# Altium project TRACKER.PrjPcb (part 2 of 3)

## Sheet SLAVE.SchDoc
size A4; SheetNumber: 2; SheetTotal: 3
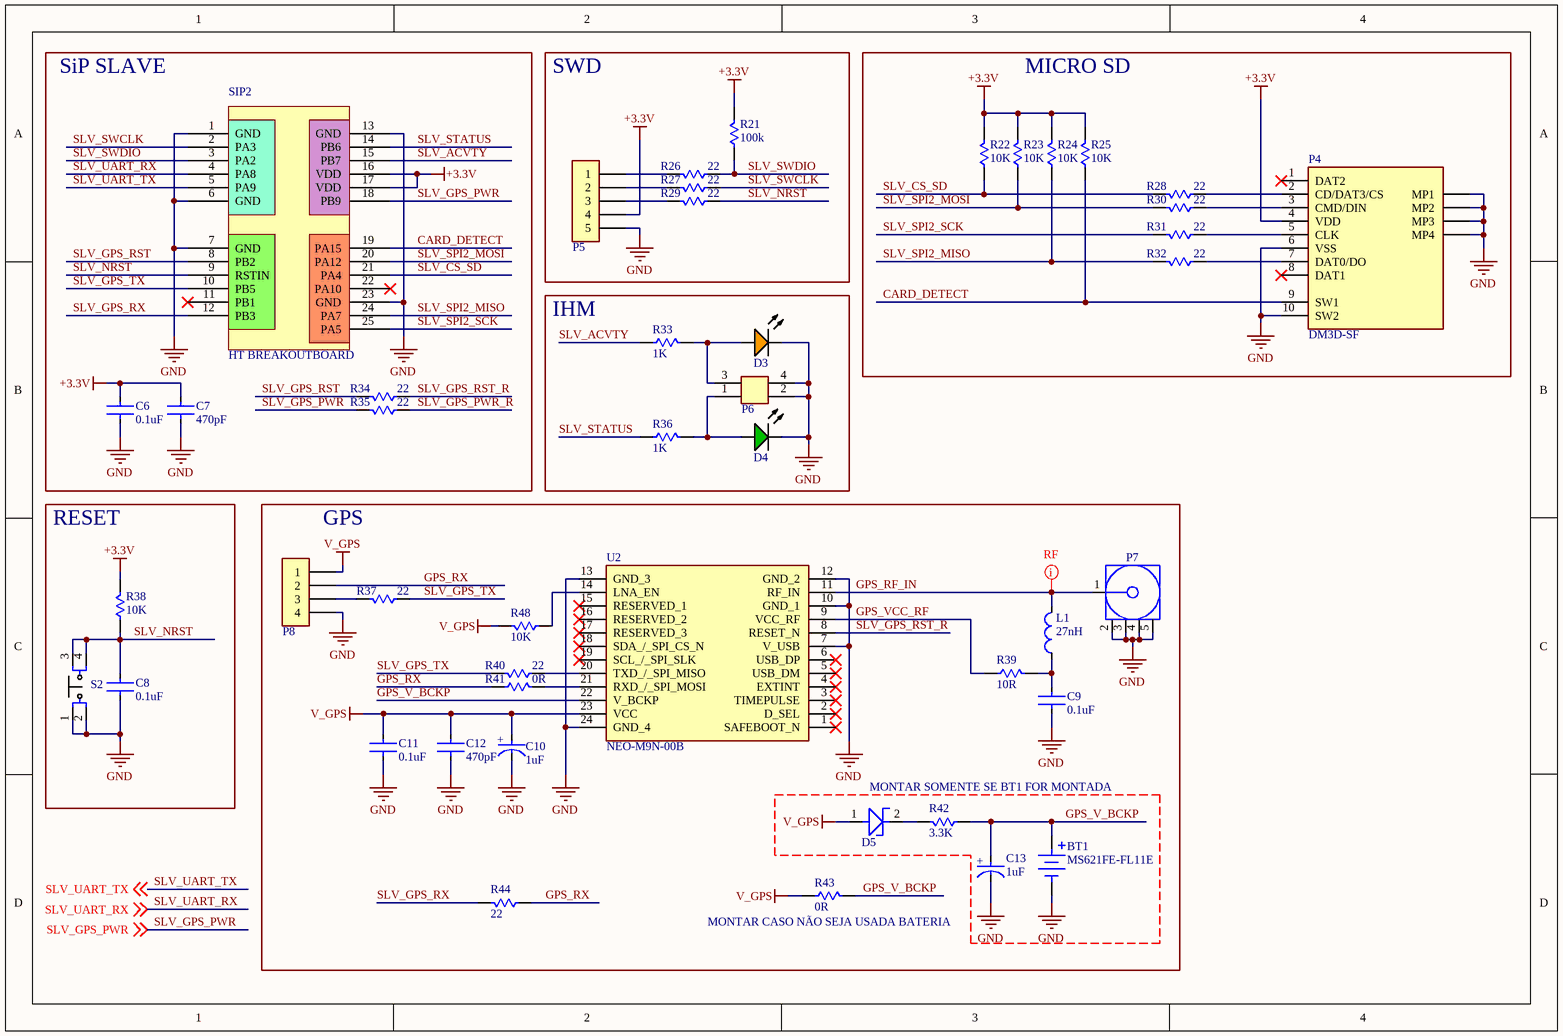
[diagram p1: SLAVE.SchDoc]

### Parts
BT1  MS621FE-FL11E  [BAT_MS621FE-FL11E]
C6  0.1uF  [0805-CAP]
C7  470pF  [0805-CAP]
C8  0.1uF  [0805-CAP]
C9  0.1uF  [0805-CAP]
C10  1uF  [1206-CAP-TANT]
C11  0.1uF  [0805-CAP]
C12  470pF  [0805-CAP]
C13  1uF  [1206-CAP-TANT]
D3  ORANGE  [0805-LED-ORANGE]  (value not drawn)
D4  GREEN  [0805-LED-GREEN]  (value not drawn)
D5  NRVB120VLSFT1G  [SOD-123]  (value not drawn)
L1  27nH  [PE-0603CD270JTT]
P4  DM3D-SF  [DM3DSF]
P5  Header 6  [_HEADER_5P_PVF]  (value not drawn)
P6  _HEADER_2X2_PVM_2.54MM  [67997-404HLF]  (value not drawn)
P7  CON-SMA-EDGE-S  [CON-SMA-EDGE-S]  (value not drawn)
P8  NEO-5M-MODULE-WITHOUT-PPS  [NEO-5M-MODULE-NO-PPS]  (value not drawn)
R21  100k  [0805-RES]
R22  10K  [0805-RES]
R23  10K  [0805-RES]
R24  10K  [0805-RES]
R25  10K  [0805-RES]
R26  22  [0805-RES]
R27  22  [0805-RES]
R28  22  [0805-RES]
R29  22  [0805-RES]
R30  22  [0805-RES]
R31  22  [0805-RES]
R32  22  [0805-RES]
R33  1K  [0805-RES]
R34  22  [0805-RES]
R35  22  [0805-RES]
R36  1K  [0805-RES]
R37  22  [0805-RES]
R38  10K  [0805-RES]
R39  10R  [0805-RES]
R40  22  [0805-RES]
R41  0R  [0805-RES]
R42  3.3K  [0805-RES]
R43  0R  [0805-RES]
R44  22  [0805-RES]
R48  10K  [0805-RES]
S2  EVQ-P7A01P  [EVQP7A]  (value not drawn)
SIP2  HT BREAKOUTBOARD  [HT BREAKOUTBOARD PINS]
U2  NEO-M9N-00B  [NEO-M9N-00B-MFG]

### Blocks framed on the sheet
SiP SLAVE: C6 C7 R34 R35 SIP2
SWD: P5 R21 R26 R27 R29
MICRO SD: P4 R22-R25 R28 R30-R32
IHM: D3 D4 P6 R33 R36
RESET: C8 R38 S2
GPS: C9-C12 L1 P7 P8 R37 R39-R41 R43 R44 R48 U2
MONTAR SOMENTE SE BT1 FOR MONTADA: BT1 C13 D5 R42

### Nets
+3.3V: C6.1 C7.1 P4.4(VDD) P5.4 R21.2 R22.2 R23.2 R24.2 R25.2 R38.2 SIP2.16(VDD) SIP2.17(VDD)
GND: BT1.NEG C6.2 C7.2 C8.2 C9.1 C10.2(C) C11.2 C12.2 C13.2(C) D3.2(K) D4.2(K) P4.6(VSS) P4.10(SW2) P4.MP1 P4.MP2 P4.MP3 P4.MP4 P5.5 P6.2 P6.4 P7.2(GND1) P7.3(GND2) P7.4(GND3) P7.5(GND4) P8.4 S2.1 S2.2 SIP2.1(GND) SIP2.6(GND) SIP2.7(GND) SIP2.13(GND) SIP2.23(GND) U2.7(V_USB) U2.10(GND_1) U2.12(GND_2) U2.13(GND_3) U2.24(GND_4)
V_GPS: C10.1(A) C11.1 C12.1 D5.1 P8.1 R43.1 R48.2 U2.23(VCC)
CARD_DETECT: P4.9(SW1) R25.1 SIP2.19(PA15)
GPS_RF_IN: L1.2 P7.1(SIGNAL) U2.11(RF_IN)
GPS_RX: P8.2 R41.1 R44.1
GPS_V_BCKP: BT1.POS C13.1(A) R42.1 R43.2 U2.22(V_BCKP)
GPS_VCC_RF: R39.1 U2.9(VCC_RF)
SLV_ACVTY: R33.1 SIP2.15(PB7)
SLV_CS_SD: R22.1 R28.2 SIP2.21(PA4)
SLV_GPS_PWR: R35.2 SIP2.18(PB9) ; off-sheet SLV_GPS_PWR
SLV_GPS_PWR_R: R35.1
SLV_GPS_RST: R34.2 SIP2.8(PB2)
SLV_GPS_RST_R: R34.1 U2.8(RESET_N)
SLV_GPS_RX: R44.2 SIP2.12(PB3)
SLV_GPS_TX: R37.1 R40.2 SIP2.10(PB5)
SLV_NRST: C8.1 R29.1 R38.1 S2.3 S2.4 SIP2.9(RSTIN)
SLV_SPI2_MISO: R24.1 R32.2 SIP2.24(PA7)
SLV_SPI2_MOSI: R23.1 R30.2 SIP2.20(PA12)
SLV_SPI2_SCK: R31.2 SIP2.25(PA5)
SLV_STATUS: R36.1 SIP2.14(PB6)
SLV_SWCLK: R27.1 SIP2.2(PA3)
SLV_SWDIO: R21.1 R26.1 SIP2.3(PA2)
SLV_UART_RX: SIP2.4(PA8) ; off-sheet SLV_UART_RX
SLV_UART_TX: SIP2.5(PA9) ; off-sheet SLV_UART_TX
NetC9_2: C9.2 L1.1 R39.2
NetD3_1: D3.1(A) P6.3 R33.2
NetD4_1: D4.1(A) P6.1 R36.2
NetD5_2: D5.2 R42.2
NetP4_2: P4.2(CD/DAT3/CS) R28.1
NetP4_3: P4.3(CMD/DIN) R30.1
NetP4_5: P4.5(CLK) R31.1
NetP4_7: P4.7(DAT0/DO) R32.1
NetP5_1: P5.1 R26.2
NetP5_2: P5.2 R27.2
NetP5_3: P5.3 R29.2
NetP8_3: P8.3 R37.2
NetR40_1: R40.1 U2.20(TXD_/_SPI_MISO)
NetR41_2: R41.2 U2.21(RXD_/_SPI_MOSI)
NetR48_1: R48.1 U2.14(LNA_EN)

Not connected (* = marked no-connect by the designer): P4 1(DAT2)* 8(DAT1)*; SIP2 11(PB1)* 22(PA10)*; U2 1(SAFEBOOT_N)* 2(D_SEL)* 3(TIMEPULSE)* 4(EXTINT)* 5(USB_DM)* 6(USB_DP)* 15(RESERVED_1)* 16(RESERVED_2)* 17(RESERVED_3)* 18(SDA_/_SPI_CS_N)* 19(SCL_/_SPI_SLK)*

### Layout directives
net class RF: GPS_RF_IN

### Notes on the sheet
- (near R43) MONTAR CASO NÃO SEJA USADA BATERIA
- Title:
- Author:
- Sheet:
- Date:
- Revision:
- /
- (in symbol TAJA105K020RNJ) +

### Library data of the parts
BT1 = MS621FE-FL11E: MS621FE-FL11E Coin Cell, Lithium, 5.5MAH, 3V Rechargeable Rohs; Manufacturer: Seiko; Number of Cells: 1; Battery Size: 621; Battery Type: SECONDARY; Outside Diameter: 6.8mm; Lead Length: 1.7mm; Supplier 1: Mouser; Manufacturer Part Number: MS621FE-FL11E; RoHS: Yes; Category: Batteries and Accessories; Stock 1: 1781; Pricing 1: 1=2,19, 10=1,82, 50=1,6, 100=1,43, 1000=1,18, 10000=1,1 (USD); Pins: 2; Weight: 0.23g; Min Operating Temperature: -20°C; Max Operating Temperature: 60°C; Capacity: 5.5mAh; Chemistry/Technology: Lithium; Output Voltage: 3V; Package Quantity: 100; Voltage Rating: 3V; Termination: SMD/SMT; Series: MS621FE; Battery Chemistry: LITHIUM; Packaging: Tray; Voltage: 3V; Orientation: Vertical; Diameter: 6.8mm; Width: 6.8mm; Height: 2.1mm; Radiation Hardening: No; Reach SVHC Compliant: Yes; ComponentLink1URL: http://www.onlinecomponents.com/productFiles/mf-SIB/file_product_master_50112_title_imagesp.pdf?src-supplier=Onlinecomponents.com; ComponentLink1Description: http://www.onlinecomponents.com/productFiles/mf-SIB/file_product_master_50112_title_imagesp.pdf?src-supplier=Onlinecomponents.com; ComponentLink2URL: http://www.farnell.com/datasheets/2700315.pdf?src-supplier=Farnell; ComponentLink2Description: http://www.farnell.com/datasheets/2700315.pdf?src-supplier=Farnell; ComponentLink3URL: http://www.farnell.com/datasheets/2700315.pdf?src-supplier=Element14; ComponentLink3Description: http://www.farnell.com/datasheets/2700315.pdf?src-supplier=Element14; ComponentLink4URL: http://www.onlinecomponents.com/datasheet/ms621fefl11e.aspx?p=12337810&src-supplier=Onlinecomponents.com; ComponentLink4Description: http://www.onlinecomponents.com/datasheet/ms621fefl11e.aspx?p=12337810&src-supplier=Onlinecomponents.com; ComponentLink5URL: http://www.sii.co.jp/en/me/datasheets/ms-rechargeable/ms621fe/?src-supplier=Mouser; ComponentLink5Description: http://www.sii.co.jp/en/me/datasheets/ms-rechargeable/ms621fe/?src-supplier=Mouser; ComponentLink6URL: https://www.sii.co.jp/en/me/files/2018/04/MicroBattery_catalogue_E_2018_forWeb.pdf?src-supplier=Digi-Key; ComponentLink6Description: https://www.sii.co.jp/en/me/files/2018/04/MicroBattery_catalogue_E_2018_forWeb.pdf?src-supplier=Digi-Key; ComponentLink7URL: http://speed.sii.co.jp/data/file_PRODUCT_MASTER_50112_TITLE_IMAGESP.pdf?src-supplier=Avnet; ComponentLink7Description: http://speed.sii.co.jp/data/file_PRODUCT_MASTER_50112_TITLE_IMAGESP.pdf?src-supplier=Avnet; ComponentLink8URL: https://datasheet.octopart.com/MS621FE-FL11E-Seiko-datasheet-154792866.pdf?src-supplier=Master+Electronics; ComponentLink8Description: https://datasheet.octopart.com/MS621FE-FL11E-Seiko-datasheet-154792866.pdf?src-supplier=Master+Electronics; Supplier Part Number 1: 628-MS621FE-FL11E
C6 C8 C9 C11 = AC0805KRX7R7BB104: CAP CER SMD 0805, 0.1uF / 16V, ±10%; Manufacturer: Yageo; Value: 100nF; ComponentLink1URL: http://www.yageo.com/NewPortal/_en/search/productDocs.jsp?YageoPartNumber=AC0805KRX7R7BB104&src-supplier=Digi-Key; ComponentLink1Description: http://www.yageo.com/NewPortal/_en/search/productDocs.jsp?YageoPartNumber=AC0805KRX7R7BB104&src-supplier=Digi-Key; Supplier 1: Mouser; Manufacturer Part Number: AC0805KRX7R7BB104; RoHS: Yes; Category: Ceramic Capacitors; Stock 1: 118257; Pricing 1: 1=0,19, 10=0,079, 50=0,079, 100=0,046, 1000=0,041, 10000=0,028 (USD); Case/Package: 0805; Case Code (Metric): 2012; Case Code (Imperial): 0805; Min Operating Temperature: -55°C; Max Operating Temperature: 125°C; Tolerance: 10%; Packaging: Cut Tape; Voltage Rating: 16V; Series: AC; Ratings: AEC-Q200; RoHS Compliant: Yes; Supplier Part Number 1: 603-AC805KRX7R7BB104; Mounting Technology: Surface Mount; Supplier 2: Digi-Key; Supplier 3: Digi-Key; Supplier Part Number 2: 311-3162-1-ND; Supplier Part Number 3: 311-3162-6-ND
C7 C12 = 885012007086: CAP CER SMD 0805, 470pF / 100V, ±5% C0G/NP0; Manufacturer: Wurth Electronics; Supplier 1: Mouser; Manufacturer Part Number: 885012007086; RoHS: No; Category: Ceramic Capacitors; Stock 1: 9461; Pricing 1: 1=0,1, 10=0,08, 50=0,08, 100=0,072, 1000=0,064, 10000=0,054 (USD); Case/Package: 0805; Case Code (Metric): 2012; Case Code (Imperial): 0805; Min Operating Temperature: -55°C; Max Operating Temperature: 125°C; Packaging: Cut Tape; Voltage Rating: 100V; Tolerance: 5%; ComponentLink1URL: https://katalog.we-online.de/pbs/datasheet/885012007086.pdf?src-supplier=Digi-Key; ComponentLink1Description: https://katalog.we-online.de/pbs/datasheet/885012007086.pdf?src-supplier=Digi-Key; Supplier Part Number 1: 710-885012007086; Mounting Technology: Surface Mount; Value: 470pF; Series: WCAP-CSGP; ComponentLink6URL: https://katalog.we-online.de/pbs/datasheet/885012007086.pdf?src-supplier=Digi-Key; ComponentLink6Description: https://katalog.we-online.de/pbs/datasheet/885012007086.pdf?src-supplier=Digi-Key; Supplier 2: Digi-Key; Supplier 3: Digi-Key; Supplier Part Number 2: 732-12213-1-ND; Supplier Part Number 3: 732-12213-6-ND
C10 = TAJA105K020RNJ: CAP TANT SMD 1206, 1uF / 20V, ±10%; Manufacturer: Kyocera AVX; Dielectric Material: Tantalum; Tolerance: 20%; ESR (Equivalent Series Resistance): 9R; Leakage Current: 500nA; Polarity: Polar; Dissipation Factor: 4%; Supplier 1: Mouser; Manufacturer Part Number: TAJA105K020RNJ; RoHS: Yes; Category: Tantalum Capacitors; Stock 1: 2000; Pricing 1: 2000=0,09520 (USD); Mount: Surface Mount,PCB; Case/Package: 1206; Number of Pins: 2; Case Code (Imperial): 1206; Case Code (Metric): 3216; Min Operating Temperature: -55°C; Max Operating Temperature: 125°C; Capacitance: 1uF; Voltage Rating: 20V; Voltage Rating (DC): 20V; Package Quantity: 1; Packaging: Tape and Reel; Termination: SMD/SMT; Voltage: 20V; Features: General Purpose; Series: TAJ; Construction: Flat; Length: 3.2mm; Width: 1.6mm; Height: 1.6mm; Height - Seated (Max): 0.071inch; Depth: 1.6mm; Radiation Hardening: No; REACH SVHC: No SVHC; Lead Free: Lead Free; RoHS Compliant: Yes; ComponentLink1URL: https://datasheet.ciiva.com/11794/0900766b80ccdc61-11794382.pdf?src-supplier=RSComponents; ComponentLink1Description: https://datasheet.ciiva.com/11794/0900766b80ccdc61-11794382.pdf?src-supplier=RSComponents; ComponentLink2URL: https://datasheet.ciiva.com/12883/taj-27497-12883280.pdf?src-supplier=Mouser; ComponentLink2Description: https://datasheet.ciiva.com/12883/taj-27497-12883280.pdf?src-supplier=Mouser; ComponentLink3URL: https://datasheet.ciiva.com/263/taj-263413.pdf?src-supplier=Digi-Key; ComponentLink3Description: https://datasheet.ciiva.com/263/taj-263413.pdf?src-supplier=Digi-Key; ComponentLink4URL: https://datasheet.ciiva.com/263/taj-263412.pdf?src-supplier=Digi-Key; ComponentLink4Description: https://datasheet.ciiva.com/263/taj-263412.pdf?src-supplier=Digi-Key; ComponentLink5URL: https://datasheet.ciiva.com/263/taj-263414.pdf?src-supplier=Digi-Key; ComponentLink5Description: https://datasheet.ciiva.com/263/taj-263414.pdf?src-supplier=Digi-Key; ComponentLink6URL: https://datasheet.ciiva.com/14608/70001050-14608053.pdf?src-supplier=Allied+Electronics; ComponentLink6Description: https://datasheet.ciiva.com/14608/70001050-14608053.pdf?src-supplier=Allied+Electronics; ComponentLink7URL: https://datasheet.ciiva.com/14598/70001050-14598921.pdf?src-supplier=Allied+Electronics; ComponentLink7Description: https://datasheet.ciiva.com/14598/70001050-14598921.pdf?src-supplier=Allied+Electronics; ComponentLink8URL: https://datasheet.ciiva.com/3004/taj-3004373.pdf?src-supplier=Avnet; ComponentLink8Description: https://datasheet.ciiva.com/3004/taj-3004373.pdf?src-supplier=Avnet; ComponentLink9URL: https://datasheet.ciiva.com/16203/taj-16203563.pdf?src-supplier=Future+Electronics; ComponentLink9Description: https://datasheet.ciiva.com/16203/taj-16203563.pdf?src-supplier=Future+Electronics; ComponentLink10URL: https://datasheet.ciiva.com/3004/taj-3004372.pdf?src-supplier=Avnet; ComponentLink10Description: https://datasheet.ciiva.com/3004/taj-3004372.pdf?src-supplier=Avnet; Supplier Part Number 1: 581-TAJA105K020; Supplier 2: Digi-Key; Supplier Part Number 2: 478-1650-1-ND; Supplier 3: Digi-Key; Supplier Part Number 3: 478-1650-6-ND
C13 = TAJA105K020RNJ: CAP TANT SMD 1206, 1uF / 20V, ±10%; Manufacturer: Kyocera AVX; Tolerance: 20%; Dissipation Factor: 4%; Dielectric Material: Tantalum; ESR (Equivalent Series Resistance): 9R; Leakage Current: 500nA; Polarity: Polar; Supplier 1: Mouser; Manufacturer Part Number: TAJA105K020RNJ; RoHS: Yes; Category: Tantalum Capacitors; Stock 1: 2000; Pricing 1: 2000=0,09520 (USD); Mount: Surface Mount,PCB; Case/Package: 1206; Case Code (Metric): 3216; Case Code (Imperial): 1206; Min Operating Temperature: -55°C; Max Operating Temperature: 125°C; Capacitance: 1uF; Packaging: Tape and Reel; Package Quantity: 1; Voltage Rating: 20V; Voltage: 20V; Series: TAJ; Construction: Flat; Length: 3.2mm; Width: 1.6mm; Height: 1.6mm; Depth: 1.6mm; Radiation Hardening: No; RoHS Compliant: Yes; ComponentLink1URL: https://datasheet.ciiva.com/11794/0900766b80ccdc61-11794382.pdf?src-supplier=RSComponents; ComponentLink1Description: https://datasheet.ciiva.com/11794/0900766b80ccdc61-11794382.pdf?src-supplier=RSComponents; ComponentLink2URL: https://datasheet.ciiva.com/12883/taj-27497-12883280.pdf?src-supplier=Mouser; ComponentLink2Description: https://datasheet.ciiva.com/12883/taj-27497-12883280.pdf?src-supplier=Mouser; Supplier Part Number 1: 581-TAJA105K020; Number of Pins: 2; Voltage Rating (DC): 20V; Termination: SMD/SMT; Lead Free: Lead Free; ComponentLink3URL: https://datasheet.ciiva.com/263/taj-263413.pdf?src-supplier=Digi-Key; ComponentLink3Description: https://datasheet.ciiva.com/263/taj-263413.pdf?src-supplier=Digi-Key; ComponentLink4URL: https://datasheet.ciiva.com/263/taj-263412.pdf?src-supplier=Digi-Key; ComponentLink4Description: https://datasheet.ciiva.com/263/taj-263412.pdf?src-supplier=Digi-Key; ComponentLink5URL: https://datasheet.ciiva.com/263/taj-263414.pdf?src-supplier=Digi-Key; ComponentLink5Description: https://datasheet.ciiva.com/263/taj-263414.pdf?src-supplier=Digi-Key; ComponentLink6URL: https://datasheet.ciiva.com/14608/70001050-14608053.pdf?src-supplier=Allied+Electronics; ComponentLink6Description: https://datasheet.ciiva.com/14608/70001050-14608053.pdf?src-supplier=Allied+Electronics; ComponentLink7URL: https://datasheet.ciiva.com/14598/70001050-14598921.pdf?src-supplier=Allied+Electronics; ComponentLink7Description: https://datasheet.ciiva.com/14598/70001050-14598921.pdf?src-supplier=Allied+Electronics; ComponentLink8URL: https://datasheet.ciiva.com/3004/taj-3004373.pdf?src-supplier=Avnet; ComponentLink8Description: https://datasheet.ciiva.com/3004/taj-3004373.pdf?src-supplier=Avnet; ComponentLink9URL: https://datasheet.ciiva.com/16203/taj-16203563.pdf?src-supplier=Future+Electronics; ComponentLink9Description: https://datasheet.ciiva.com/16203/taj-16203563.pdf?src-supplier=Future+Electronics; Features: General Purpose; Height - Seated (Max): 0.071inch; REACH SVHC: No SVHC; ComponentLink10URL: https://datasheet.ciiva.com/3004/taj-3004372.pdf?src-supplier=Avnet; ComponentLink10Description: https://datasheet.ciiva.com/3004/taj-3004372.pdf?src-supplier=Avnet; Supplier 2: Digi-Key; Supplier Part Number 2: 478-1650-1-ND; Supplier 3: Digi-Key; Supplier Part Number 3: 478-1650-6-ND
D3 = LTST-C170AKT: LED ORANGE, SMD 0805, 2.1V/30mA; Manufacturer: Vishay Lite-On; Lens Color: Colorless; Number of LEDs: 1; Reverse Voltage: 5V; Viewing Angle: 130°; Lens Style: Diffused,Colorless,Rectangular,Clear; Luminous Intensity: 2mcd; Forward Voltage: 2.1V; Dominant Wavelength: 602nm; Test Current: 10mA; Lens Transparency: Clear; Wavelength: 610nm; Forward Current: 30mA; Max Power Dissipation: 100mW; Supplier 1: Mouser; Manufacturer Part Number: LTST-C170AKT; RoHS: Yes; Category: LEDs; Stock 1: 1201; Pricing 1: 1=0,2162, 10=0,1414, 25=0,1404, 100=0,0749, 250=0,0738, 500=0,0682, 1000=0,0546 (USD); Case/Package: 0805; Color: Orange; Case Code (Metric): 2012; Case Code (Imperial): 0805; Min Operating Temperature: -55°C; Max Operating Temperature: 85°C; Package Quantity: 1; Packaging: Tape and Reel; Series: CHIPLED 0805; Illumination Color: Orange; Number of Elements: 1; Power Dissipation: 100mW; Length: 2mm; Width: 1.25mm; Height: 1.1mm; Depth: 1.25mm; Radiation Hardening: No; Lead Free: Lead Free; RoHS Compliant: Yes; ComponentLink1URL: https://datasheet.ciiva.com/11773/0900766b80dc0275-11773962.pdf?src-supplier=Rs; ComponentLink1Description: https://datasheet.ciiva.com/11773/0900766b80dc0275-11773962.pdf?src-supplier=Rs; ComponentLink2URL: https://datasheet.ciiva.com/16388/lite-on20ltst-c170akt-16388570.pdf?src-supplier=Future+Electronics; ComponentLink2Description: https://datasheet.ciiva.com/16388/lite-on20ltst-c170akt-16388570.pdf?src-supplier=Future+Electronics; ComponentLink3URL: https://datasheet.ciiva.com/19466/1996129-19466129.pdf?src-supplier=Jameco; ComponentLink3Description: https://datasheet.ciiva.com/19466/1996129-19466129.pdf?src-supplier=Jameco; ComponentLink4URL: https://datasheet.ciiva.com/12400/lite-on-ltst-c170akt-187687-12400757.pdf?src-supplier=Mouser; ComponentLink4Description: https://datasheet.ciiva.com/12400/lite-on-ltst-c170akt-187687-12400757.pdf?src-supplier=Mouser; ComponentLink5URL: https://datasheet.ciiva.com/2110/ltst-c170akt-2110108.pdf?src-supplier=Digi-Key; ComponentLink5Description: https://datasheet.ciiva.com/2110/ltst-c170akt-2110108.pdf?src-supplier=Digi-Key; ComponentLink6URL: https://datasheet.ciiva.com/15117/getdatasheetpartid-147503-15117857.pdf?src-supplier=Verical; ComponentLink6Description: https://datasheet.ciiva.com/15117/getdatasheetpartid-147503-15117857.pdf?src-supplier=Verical; ComponentLink7URL: https://datasheet.ciiva.com/2110/ltst-c170akt-2110109.pdf?src-supplier=Digi-Key; ComponentLink7Description: https://datasheet.ciiva.com/2110/ltst-c170akt-2110109.pdf?src-supplier=Digi-Key; ComponentLink8URL: https://datasheet.ciiva.com/2110/ltst-c170akt-2110110.pdf?src-supplier=Digi-Key; ComponentLink8Description: https://datasheet.ciiva.com/2110/ltst-c170akt-2110110.pdf?src-supplier=Digi-Key; Supplier Part Number 1: 859-LTST-C170AKT; Mounting Technology: Surface Mount; Pins: 2; Supplier 2: Digi-Key; Supplier Part Number 2: 160-1177-1-ND; Supplier 3: Digi-Key; Supplier Part Number 3: 160-1177-6-ND
D4 = LTST-C170GKT: LED GREEN, SMD 0805, 2.1V/30mA; Manufacturer: Vishay Lite-On; Lens Color: Colorless; Luminous Intensity: 6mcd; Forward Current: 30mA; Viewing Angle: 130°; Forward Voltage: 2.1V; Lens Style: Flat,Diffused,Colorless,Rectangular; Power Rating: 100mW; Lens Transparency: Clear; Test Current: 10mA; Dominant Wavelength: 569nm; Number of Elements: 1; Wavelength: 565nm; Reverse Voltage: 5V; Lens Size: 1.25mm; Supplier 1: Mouser; Manufacturer Part Number: LTST-C170GKT; RoHS: Yes; Category: LEDs; Stock 1: 34600; Pricing 1: 250=0,062, 500=0,055, 1250=0,043, 2500=0,041 (GBP); Case/Package: 0805; Color: Green; Case Code (Metric): 2012; Case Code (Imperial): 0805; Min Operating Temperature: -55°C; Max Operating Temperature: 85°C; Packaging: Tape and Reel; Package Quantity: 3000; Illumination Color: Green; Power Dissipation: 100mW; Number of LEDs: 1; Series: -; Length: 2mm; Width: 1.25mm; Height: 1.1mm; Depth: 1.25mm; Radiation Hardening: No; Lead Free: Lead Free; RoHS Compliant: Yes; ComponentLink1URL: https://datasheet.ciiva.com/11773/0900766b80dc0278-11773630.pdf?src-supplier=Rs; ComponentLink1Description: https://datasheet.ciiva.com/11773/0900766b80dc0278-11773630.pdf?src-supplier=Rs; ComponentLink2URL: https://datasheet.ciiva.com/25772/ltst-c170gkt-25772881.pdf?src-supplier=Allied+Electronics; ComponentLink2Description: https://datasheet.ciiva.com/25772/ltst-c170gkt-25772881.pdf?src-supplier=Allied+Electronics; ComponentLink3URL: https://datasheet.ciiva.com/2110/ltst-c170gkt-2110128.pdf?src-supplier=Digi-Key; ComponentLink3Description: https://datasheet.ciiva.com/2110/ltst-c170gkt-2110128.pdf?src-supplier=Digi-Key; ComponentLink4URL: https://datasheet.ciiva.com/12400/lite-on-ltst-c170gkt-187191-12400783.pdf?src-supplier=Mouser; ComponentLink4Description: https://datasheet.ciiva.com/12400/lite-on-ltst-c170gkt-187191-12400783.pdf?src-supplier=Mouser; ComponentLink5URL: https://datasheet.ciiva.com/15117/getdatasheetpartid-142079-15117738.pdf?src-supplier=Verical; ComponentLink5Description: https://datasheet.ciiva.com/15117/getdatasheetpartid-142079-15117738.pdf?src-supplier=Verical; ComponentLink6URL: https://datasheet.ciiva.com/16387/ltst-c170gkt-16387357.pdf?src-supplier=Future+Electronics; ComponentLink6Description: https://datasheet.ciiva.com/16387/ltst-c170gkt-16387357.pdf?src-supplier=Future+Electronics; Supplier Part Number 1: 859-LTST-C170GKT; Mounting Technology: Surface Mount; Pins: 2; Voltage: 5V; Supplier 2: Digi-Key; Supplier Part Number 2: 160-1179-1-ND; Supplier 3: Digi-Key; Supplier Part Number 3: 160-1179-6-ND
D5 = NRVB120VLSFT1G: DIODE SHOTTKY SMD SOD-123F, 0,3V/1A, VBR 20V; Manufacturer: ON Semiconductor; Average Rectified Current: 1A; Max Reverse Current: 15mA; Peak Non-Repetitive Surge Current: 45A; Element Configuration: Single; ComponentLink1Description: http://www.farnell.com/datasheets/2028665.pdf?src-supplier=Farnell; ComponentLink1URL: http://www.farnell.com/datasheets/2028665.pdf?src-supplier=Farnell; Supplier 1: Mouser; Manufacturer Part Number: NRVB120VLSFT1G; RoHS: Yes; Category: Schottky Diodes; Stock 1: 170; Pricing 1: 1=0,51000, 5=0,51000, 10=0,43400, 25=0,39700, 50=0,36100, 100=0,32400, 250=0,28900, 500=0,25400, 1000=0,19700 (USD); Mount: Surface Mount; Case/Package: SOD; Number of Pins: 2; Min Operating Temperature: -65°C; Max Operating Temperature: 125°C; Packaging: Tape and Reel; Max Repetitive Reverse Voltage (Vrrm): 20V; Max Reverse Voltage (DC): 20V; Lead Free: Lead Free; RoHS Compliant: Yes; ComponentLink2URL: http://www.mouser.com/ds/2/308/MBR120VLSFT1-D-1074021.pdf?src-supplier=Mouser; ComponentLink2Description: http://www.mouser.com/ds/2/308/MBR120VLSFT1-D-1074021.pdf?src-supplier=Mouser; ComponentLink3URL: http://www.onsemi.com/pub/Collateral/MBR120VLSFT1-D.PDF?src-supplier=Digi-Key; ComponentLink3Description: http://www.onsemi.com/pub/Collateral/MBR120VLSFT1-D.PDF?src-supplier=Digi-Key; ComponentLink4URL: http://www.onsemi.com/pub/Collateral/MBR120VLSFT1-D.PDF?src-supplier=Avnet; ComponentLink4Description: http://www.onsemi.com/pub/Collateral/MBR120VLSFT1-D.PDF?src-supplier=Avnet; ComponentLink5URL: http://www.farnell.com/datasheets/2028665.pdf?src-supplier=Element14; ComponentLink5Description: http://www.farnell.com/datasheets/2028665.pdf?src-supplier=Element14; ComponentLink6URL: http://www.farnell.com/datasheets/2028665.pdf?src-supplier=Newark; ComponentLink6Description: http://www.farnell.com/datasheets/2028665.pdf?src-supplier=Newark; Supplier Part Number 1: 863-NRVB120VLSFT1G; Supplier 2: Digi-Key; Supplier Part Number 2: NRVB120VLSFT1GOSCT-ND; Supplier 3: Digi-Key; Supplier Part Number 3: NRVB120VLSFT1GOSDKR-ND
L1 = PE-0603CD270JTT: Inductor RF Chip Wirewound 27nH 5% 250MHz 35Q-Factor Ceramic 600mA 220mOhm DCR 0603 T/R; Manufacturer: Pulse; Self Resonant Frequency: 2.8GHz; Shielding: Unshielded; Q Factor: 35; DC Resistance (DCR): 220mR; ComponentLink1Description: https://datasheet.ciiva.com/3867/41750067s7463805n6149-3867141.pdf?src-supplier=Arrow+Electronics; ComponentLink1URL: https://datasheet.ciiva.com/3867/41750067s7463805n6149-3867141.pdf?src-supplier=Arrow+Electronics; Supplier 1: Mouser; Manufacturer Part Number: PE-0603CD270JTT; RoHS: Yes; Category: Fixed Inductors; Stock 1: 11114; Pricing 1: 1=0,4, 10=0,268, 50=0,268, 100=0,223, 1000=0,161, 10000=0,128 (USD); Mounting Technology: Surface Mount; Case/Package: 0603; Case Code (Metric): 1608; Case Code (Imperial): 0603; Weight: 7.1E-05oz; Core Material: Ceramic; Min Operating Temperature: -40°C; Max Operating Temperature: 125°C; Package Quantity: 2000; Packaging: Tape and Reel; Tolerance: 5%; Current Rating: 600mA; Value: 27nH; Max DC Current: 600mA; Termination: SMD/SMT; Test Frequency: 250MHz; Series: 0603CD; Length: 0.071inch; Width: 0.049inch; Height: 0.64mm; Height - Seated (Max): 0.04inch; Depth: 1.24mm; Radiation Hardening: No; Lead Free: Lead Free; RoHS Compliant: Yes; ComponentLink2URL: https://datasheet.ciiva.com/48683/+wc701-48683258.pdf?src-supplier=Avnet; ComponentLink2Description: https://datasheet.ciiva.com/48683/+wc701-48683258.pdf?src-supplier=Avnet; Supplier Part Number 1: 673-PE-0603CD270JT; Supplier 2: Digi-Key; Supplier 3: Digi-Key; Supplier Part Number 2: 553-1022-1-ND; Supplier Part Number 3: 553-1022-6-ND
P4 = DM3D-SF: Memory Card Connectors MICRO SD CD CONN STD SMT PUSHPULL; Manufacturer: Hirose; Gender: Female; Contact Resistance: 100mR; Current Rating: 500mA; Voltage Rating (AC): 125V; Number of Contacts: 8; Insulation Resistance: 1GR; Pitch: 1.1mm; Supplier 1: Mouser; Manufacturer Part Number: DM3D-SF; RoHS: Yes; Category: Memory Connectors; Stock 1: 57458; Pricing 1: 1=1,82, 10=1,59, 50=1,59, 100=1,42, 1000=1,02, 10000=0,899 (USD); Mounting Technology: Surface Mount; Contact Plating: Gold; Contact Material: Copper Alloy,Copper; Housing Material: Polymer; Min Operating Temperature: -25°C; Max Operating Temperature: 85°C; Packaging: Tape and Reel; Connector Type: Connector; Series: DM3; Number of Rows: 1; Package Quantity: 1; Max Current Rating: 500mA; Termination: Solder; Orientation: Right Angle; Max Voltage Rating (AC): 125V; Length: 11.95mm; Width: 11.95mm; Depth: 11.45mm; Radiation Hardening: No; Reach SVHC Compliant: No; Lead Free: Lead Free; Flammability Rating: UL94 V-0; RoHS Compliant: Yes; ComponentLink1URL: https://datasheet.ciiva.com/11755/0900766b80fd13c1-11755152.pdf?src-supplier=Rs; ComponentLink1Description: https://datasheet.ciiva.com/11755/0900766b80fd13c1-11755152.pdf?src-supplier=Rs; ComponentLink2URL: https://datasheet.ciiva.com/1105/1697167-1105105.pdf?src-supplier=Element14; ComponentLink2Description: https://datasheet.ciiva.com/1105/1697167-1105105.pdf?src-supplier=Element14; ComponentLink3URL: https://datasheet.ciiva.com/22627/1697167-22627974.pdf?src-supplier=Farnell; ComponentLink3Description: https://datasheet.ciiva.com/22627/1697167-22627974.pdf?src-supplier=Farnell; ComponentLink4URL: https://datasheet.ciiva.com/3122/e60900232-3122537.pdf?src-supplier=Avnet; ComponentLink4Description: https://datasheet.ciiva.com/3122/e60900232-3122537.pdf?src-supplier=Avnet; ComponentLink5URL: https://datasheet.ciiva.com/15174/getdatasheetpartid-432464-15174822.pdf?src-supplier=Verical; ComponentLink5Description: https://datasheet.ciiva.com/15174/getdatasheetpartid-432464-15174822.pdf?src-supplier=Verical; ComponentLink6URL: https://datasheet.ciiva.com/16287/e60900232-16287615.pdf?src-supplier=Future+Electronics; ComponentLink6Description: https://datasheet.ciiva.com/16287/e60900232-16287615.pdf?src-supplier=Future+Electronics; ComponentLink7URL: https://datasheet.ciiva.com/683/e60900232-683362.pdf?src-supplier=Digi-Key; ComponentLink7Description: https://datasheet.ciiva.com/683/e60900232-683362.pdf?src-supplier=Digi-Key; ComponentLink8URL: https://datasheet.ciiva.com/683/e60900232-683363.pdf?src-supplier=Digi-Key; ComponentLink8Description: https://datasheet.ciiva.com/683/e60900232-683363.pdf?src-supplier=Digi-Key; ComponentLink9URL: https://datasheet.ciiva.com/683/e60900232-683364.pdf?src-supplier=Digi-Key; ComponentLink9Description: https://datasheet.ciiva.com/683/e60900232-683364.pdf?src-supplier=Digi-Key; Supplier Part Number 1: 798-DM3D-SF; Supplier 2: Digi-Key; Supplier 3: Digi-Key; Supplier Part Number 2: HR1941CT-ND; Supplier Part Number 3: HR1941DKR-ND
P5 = 75915-305LF: Dubox®, Board To Board Connector, Receptacle, Vertical, Through Hole, Single Row, Top Entry, 5 Positions, 2.54mm...; Manufacturer: Amphenol ICC / FCI; Number of Positions: 5; Gender: Female; Max Voltage Rating (AC): 1kV; Contact Resistance: 20mR; Pitch: 2.54mm; Supplier 1: Mouser; Supplier Part Number 1: 649-75915-305LF; Manufacturer Part Number: 75915-305LF; RoHS: Yes; Category: Connectors; Stock 1: 1208; Pricing 1: 1=0,9623, 10=0,7633, 25=0,7318, 50=0,6655, 100=0,6312, 500=0,4183 (USD); Mounting Technology: Through Hole; Contact Plating: Gold; Color: Blue; Contact Material: Bronze; Housing Material: Thermoplastic; Housing Color: Blue; Min Operating Temperature: -65°C; Max Operating Temperature: 125°C; Connector Type: Receptacle; Series: DUBOX™, MezzSelect™, Basics+; Packaging: Rail/Tube; Number of Rows: 1; Termination: Solder; Package Quantity: 46; Number of Contacts: 5; Orientation: Straight; Length: 12.62mm; Depth: 2.5mm; Radiation Hardening: No; ComponentLink1URL: https://datasheet.ciiva.com/10148/75915-10148925.pdf?src-supplier=Avnet; ComponentLink1Description: https://datasheet.ciiva.com/10148/75915-10148925.pdf?src-supplier=Avnet; ComponentLink2URL: https://datasheet.ciiva.com/411/75915-411935.pdf?src-supplier=Digi-Key; ComponentLink2Description: https://datasheet.ciiva.com/411/75915-411935.pdf?src-supplier=Digi-Key; Supplier 2: Digi-Key; Supplier Part Number 2: 609-5979-ND; Lead Free: Lead Free
P6 = _HEADER_2X2_PVM_2.54MM: HEADER 2X3, PTH-2.54MM, VERT, MALE
P7 = CON-SMA-EDGE-S: Sma Female Connector, Pcb Edge Mount Rohs Compliant: Yes; Manufacturer: RF Solutions; Number of Ports: 1; Supplier 1: Mouser; Manufacturer Part Number: CON-SMA-EDGE-S; RoHS: Yes; Category: RF / Coaxial Connectors; Stock 1: 11103; Pricing 1: 1=1,69 (USD); Mounting Technology: Edge,Board; Fastening Type: Threaded; Connector Type: SMA; Termination: Solder; Series: -; ComponentLink1URL: https://media.digikey.com/pdf/Data%20Sheets/RF%20Solutions%20PDFs/CON-SMA-EDGE.pdf?src-supplier=Digi-Key; ComponentLink1Description: https://media.digikey.com/pdf/Data%20Sheets/RF%20Solutions%20PDFs/CON-SMA-EDGE.pdf?src-supplier=Digi-Key; Supplier 2: Digi-Key; Supplier Part Number 1: 223-CON-SMA-EDGE-S; Supplier Part Number 2: CON-SMA-EDGE-S-ND; Case/Package: SMA
P8 = NEO-5M-MODULE-WITHOUT-PPS: NEO 5M GPS MODULE (NO PPS SIGNAL)
R21 = ERJ-6GEYJ104V: RES SMD 0805, 100K OHM 5% 1/8W; Manufacturer: Panasonic; Resistance: 100kR; Power Rating: 125mW; Voltage Rating: 150V; Temperature Coefficient: 200ppm/°C; Supplier 1: Mouser; Manufacturer Part Number: ERJ-6GEYJ104V; Stock 1: 1160981; Pricing 1: 1 = 0,10000, 10 = 0,06100, 100 = 0,02490, 1000 = 0,01120, 2500 = 0,00972 (USD); RoHS: Yes; Mount: Surface Mount; Case/Package: 0805; Weight: 0.000194oz; Case Code (Metric): 2012; Case Code (Imperial): 0805; Contact Plating: Tin; Min Operating Temperature: -55°C; Max Operating Temperature: 155°C; Tolerance: 5%; Packaging: Tape and Reel; Composition: Thick Film; Package Quantity: 5000; Number of Terminations: 2; Termination: SMD/SMT; Max Power Dissipation: 125mW; Features: Automotive AEC-Q200; Military Standard: Not; Voltage Rating (DC): 150V; Length: 2mm; Height: 0.6mm; Width: 0.049inch; Depth: 1.25mm; Radiation Hardening: No; Lead Free: Lead Free; REACH SVHC: No SVHC; ComponentLink1URL: https://datasheet.ciiva.com/11821/0900766b80f806dd-11821506.pdf?src-supplier=RSComponents; ComponentLink1Description: https://datasheet.ciiva.com/11821/0900766b80f806dd-11821506.pdf?src-supplier=RSComponents; ComponentLink2URL: https://datasheet.ciiva.com/34303/2007290-34303759.pdf?src-supplier=Jameco; ComponentLink2Description: https://datasheet.ciiva.com/34303/2007290-34303759.pdf?src-supplier=Jameco; ComponentLink3URL: https://datasheet.ciiva.com/16771/70255313-16771462.pdf?src-supplier=Allied+Electronics; ComponentLink3Description: https://datasheet.ciiva.com/16771/70255313-16771462.pdf?src-supplier=Allied+Electronics; ComponentLink4URL: https://datasheet.ciiva.com/43460/1500035-43460136.pdf?src-supplier=Farnell; ComponentLink4Description: https://datasheet.ciiva.com/43460/1500035-43460136.pdf?src-supplier=Farnell; ComponentLink5URL: https://datasheet.ciiva.com/22758/1500035-22758234.pdf?src-supplier=Farnell; ComponentLink5Description: https://datasheet.ciiva.com/22758/1500035-22758234.pdf?src-supplier=Farnell; ComponentLink6URL: https://datasheet.ciiva.com/17208/aoa0000ce1-17208156.pdf?src-supplier=Avnet+Europe; ComponentLink6Description: https://datasheet.ciiva.com/17208/aoa0000ce1-17208156.pdf?src-supplier=Avnet+Europe; ComponentLink7URL: https://datasheet.ciiva.com/30137/4aoa0000ce1-30137389.pdf?src-supplier=Onlinecomponents.com; ComponentLink7Description: https://datasheet.ciiva.com/30137/4aoa0000ce1-30137389.pdf?src-supplier=Onlinecomponents.com; ComponentLink8URL: https://datasheet.ciiva.com/9117/aoa0000ce1-9117374.pdf?src-supplier=Avnet; ComponentLink8Description: https://datasheet.ciiva.com/9117/aoa0000ce1-9117374.pdf?src-supplier=Avnet; ComponentLink9URL: https://datasheet.ciiva.com/46380/1500035-46380511.pdf?src-supplier=Element14; ComponentLink9Description: https://datasheet.ciiva.com/46380/1500035-46380511.pdf?src-supplier=Element14; Supplier Part Number 1: 667-ERJ-6GEYJ104V; Supplier 2: Digi-Key; Supplier Part Number 2: P100KACT-ND; Supplier 3: Digi-Key; Supplier Part Number 3: P100KADKR-ND
R22-R25 R38 R48 = RNCP0805FTD10K0: Res Thin Film 0805 10K Ohm 1% 1/4W ±100ppm/°C Molded SMD Paper T/R; Manufacturer: Stackpole Electronics; Value: 10kR; Max Power Dissipation: 250mW; Supplier 1: Mouser; Manufacturer Part Number: RNCP0805FTD10K0; Stock 1: 197654; Pricing 1: 1=0,1, 10=0,069, 50=0,069, 100=0,029, 1000=0,013, 10000=0,007 (USD); RoHS: Yes; Tolerance: 1%; Packaging: Cut Tape; Temperature Coefficient: 100ppm/°C; ComponentLink1URL: https://datasheet.octopart.com/RNCP0805FTD10K0-Stackpole-Electronics-datasheet-33021030.pdf?src-supplier=Future+Electronics; ComponentLink1Description: https://datasheet.octopart.com/RNCP0805FTD10K0-Stackpole-Electronics-datasheet-33021030.pdf?src-supplier=Future+Electronics; Supplier Part Number 1: 708-RNCP0805FTD10K0; Category: Chip SMD Resistors; Features: Moisture Resistant,Anti-Sulfur; Mounting Technology: Surface Mount; Case/Package: 0805; Case Code (Metric): 2012; Case Code (Imperial): 0805; Min Operating Temperature: -55°C; Max Operating Temperature: 155°C; Number of Terminations: 2; Series: RNCP; Length: 0.079inch; Width: 0.049inch; Height: 0.024inch; Lead Free: Lead Free; RoHS Compliant: Yes; ComponentLink2URL: https://www.seielect.com/catalog/SEI-Packaging.pdf?src-supplier=Digi-Key; ComponentLink2Description: https://www.seielect.com/catalog/SEI-Packaging.pdf?src-supplier=Digi-Key; Supplier 2: Digi-Key; Supplier Part Number 2: RNCP0805FTD10K0CT-ND; Supplier 3: Digi-Key; Supplier Part Number 3: RNCP0805FTD10K0DKR-ND
R26 R34 R35 = ERJ-P06J220V: RES SMD 0805, 22 OHM 5% 1/4W; Manufacturer: Panasonic; Value: 22R; Power Rating: 500mW; Voltage Rating: 150V; Temperature Coefficient: 300ppm/°C; Supplier 1: Mouser; Manufacturer Part Number: ERJ-P06J220V; RoHS: Yes; Category: Chip SMD Resistors; Stock 1: 62638; Pricing 1: 1=0,11, 10=0,056, 50=0,056, 100=0,025, 1000=0,018, 5000=0,014, 10000=0,013, 25000=0,011, 50000=0,01 (USD); Case/Package: 0805; Case Code (Metric): 2012; Case Code (Imperial): 0805; Contact Plating: Tin; Min Operating Temperature: -55°C; Max Operating Temperature: 155°C; Tolerance: 5%; Package Quantity: 1; Packaging: Tape and Reel; Number of Terminations: 2; Max Power Dissipation: 500mW; Features: Automotive AEC-Q200; Series: ERJ; Length: 0.079inch; Width: 1.2mm; Height: 0.028inch; RoHS Compliant: Yes; ComponentLink1URL: https://datasheet.ciiva.com/9191/aoa0000ce4-9191918.pdf?src-supplier=Avnet; ComponentLink1Description: https://datasheet.ciiva.com/9191/aoa0000ce4-9191918.pdf?src-supplier=Avnet; ComponentLink2URL: https://datasheet.ciiva.com/30188/aoa0000ce4-30188085.pdf?src-supplier=Onlinecomponents.com; ComponentLink2Description: https://datasheet.ciiva.com/30188/aoa0000ce4-30188085.pdf?src-supplier=Onlinecomponents.com; Supplier Part Number 1: 667-ERJ-P06J220V; Mounting Technology: Surface Mount; Voltage Rating (DC): 150V; Lead Free: Lead Free; Supplier 2: Digi-Key; Stock 2: 967; Pricing 2: 1=0,11, 10=0,095, 50=0,051, 100=0,0364, 500=0,02254, 1000=0,016 (USD); Supplier 3: Digi-Key; Stock 3: 967; Pricing 3: 1=0,11, 10=0,095, 50=0,051, 100=0,0364, 500=0,02254, 1000=0,016 (USD); Supplier Part Number 2: P22ADCT-ND; Supplier Part Number 3: P22ADDKR-ND
R27-R32 R37 R40 R44 = ERJ-P06J220V: RES SMD 0805, 22 OHM 5% 1/4W; Manufacturer: Panasonic; Power Rating: 500mW; Temperature Coefficient: 300ppm/°C; Value: 22R; Voltage Rating: 150V; Supplier 1: Mouser; Manufacturer Part Number: ERJ-P06J220V; Stock 1: 62638; Pricing 1: 1=0,11, 10=0,056, 50=0,056, 100=0,025, 1000=0,018, 5000=0,014, 10000=0,013, 25000=0,011, 50000=0,01 (USD); Case/Package: 0805; Contact Plating: Tin; Min Operating Temperature: -55°C; Max Operating Temperature: 155°C; Tolerance: 5%; Length: 0.079inch; Supplier Part Number 1: 667-ERJ-P06J220V; RoHS: Yes; Category: Chip SMD Resistors; Case Code (Metric): 2012; Case Code (Imperial): 0805; Package Quantity: 1; Packaging: Tape and Reel; Number of Terminations: 2; Max Power Dissipation: 500mW; Features: Automotive AEC-Q200; Series: ERJ; Width: 1.2mm; Height: 0.028inch; RoHS Compliant: Yes; ComponentLink1URL: https://datasheet.ciiva.com/9191/aoa0000ce4-9191918.pdf?src-supplier=Avnet; ComponentLink1Description: https://datasheet.ciiva.com/9191/aoa0000ce4-9191918.pdf?src-supplier=Avnet; ComponentLink2URL: https://datasheet.ciiva.com/30188/aoa0000ce4-30188085.pdf?src-supplier=Onlinecomponents.com; ComponentLink2Description: https://datasheet.ciiva.com/30188/aoa0000ce4-30188085.pdf?src-supplier=Onlinecomponents.com; Mounting Technology: Surface Mount; Voltage Rating (DC): 150V; Lead Free: Lead Free; Supplier 2: Digi-Key; Stock 2: 967; Pricing 2: 1=0,11, 10=0,095, 50=0,051, 100=0,0364, 500=0,02254, 1000=0,016 (USD); Supplier 3: Digi-Key; Stock 3: 967; Pricing 3: 1=0,11, 10=0,095, 50=0,051, 100=0,0364, 500=0,02254, 1000=0,016 (USD); Supplier Part Number 2: P22ADCT-ND; Supplier Part Number 3: P22ADDKR-ND
R33 R36 = RNCP0805FTD1K00: Res Thin Film 0805 1K Ohm 1% 0.25W(1/4W) ±100ppm/C Sulfur Resistant Pad SMD T/R; Manufacturer: Stackpole Electronics; Temperature Coefficient: 100ppm/°C; Value: 1kR; Power Rating: 250mW; Supplier 1: Mouser; Manufacturer Part Number: RNCP0805FTD1K00; RoHS: Yes; Category: Chip SMD Resistors; Stock 1: 70653; Pricing 1: 1=0,1, 10=0,069, 50=0,069, 100=0,029, 1000=0,013, 10000=0,007 (USD); Packaging: Cut Tape; Features: Moisture Resistant,Anti-Sulfur; ComponentLink1URL: http://www.seielect.com/Catalog/SEI-rncp.pdf?src-supplier=Future+Electronics; ComponentLink1Description: http://www.seielect.com/Catalog/SEI-rncp.pdf?src-supplier=Future+Electronics; Supplier Part Number 1: 708-RNCP0805FTD1K00; Tolerance: 1%; Mounting Technology: Surface Mount; Case/Package: 0805; Case Code (Metric): 2012; Case Code (Imperial): 0805; Min Operating Temperature: -55°C; Max Operating Temperature: 155°C; Number of Terminations: 2; Max Power Dissipation: 250mW; Series: RNCP; Length: 0.079inch; Width: 0.049inch; Height: 0.024inch; Lead Free: Lead Free; RoHS Compliant: Yes; ComponentLink2URL: https://www.seielect.com/catalog/SEI-Packaging.pdf?src-supplier=Digi-Key; ComponentLink2Description: https://www.seielect.com/catalog/SEI-Packaging.pdf?src-supplier=Digi-Key; ComponentLink3URL: https://www.seielect.com/Catalog/SEI-rncp.pdf?src-supplier=Digi-Key; ComponentLink3Description: https://www.seielect.com/Catalog/SEI-rncp.pdf?src-supplier=Digi-Key; Supplier 2: Digi-Key; Supplier 3: Digi-Key; Supplier Part Number 2: RNCP0805FTD1K00CT-ND; Supplier Part Number 3: RNCP0805FTD1K00DKR-ND
R39 = CRCW080510R0FKEAHP: RES SMD 0805, 10 OHM 1% 1/3W; Manufacturer: Vishay; Temperature Coefficient: 100ppm/°C; Max Power Dissipation: 333mW; Power Rating: 330mW; Voltage Rating: 150V; ComponentLink1Description: https://datasheet.ciiva.com/5549/crcwhpe3-46056-5549342.pdf?src-supplier=Mouser; ComponentLink1URL: https://datasheet.ciiva.com/5549/crcwhpe3-46056-5549342.pdf?src-supplier=Mouser; Supplier 1: Mouser; Manufacturer Part Number: CRCW080510R0FKEAHP; RoHS: Yes; Category: Chip SMD Resistors; Stock 1: 690923; Pricing 1: 1=0,19, 10=0,103, 50=0,103, 100=0,046, 1000=0,026, 10000=0,022 (USD); Case/Package: 0805; Contact Plating: Tin; Min Operating Temperature: -55°C; Max Operating Temperature: 155°C; Tolerance: 1%; Lead Free: Lead Free; RoHS Compliant: Yes; ComponentLink2URL: https://datasheet.ciiva.com/22673/1885357-22673082.pdf?src-supplier=Element14; ComponentLink2Description: https://datasheet.ciiva.com/22673/1885357-22673082.pdf?src-supplier=Element14; Supplier Part Number 1: 71-CRCW080510R0FKEAH; Value: 10R; Weight: 0.000194oz; Case Code (Imperial): 0805; Case Code (Metric): 2012; Packaging: Tape and Reel; Package Quantity: 5000; Series: CRCW-HP; Resistor Type: Thick Film; Termination: SMD/SMT; Voltage Rating (DC): 150V; Features: Automotive AEC-Q200; Number of Terminations: 2; Resistance Tolerance: 1%; Technology: THICK FILM; Construction: Rectangular; Length: 2mm; Width: 1.2mm; Height: 0.5mm; Depth: 1.25mm; Ratings: AEC-Q200; Radiation Hardening: No; Military Standard: Not; Reach SVHC Compliant: Unknown; ComponentLink3URL: https://datasheet.ciiva.com/22673/1885357-22673083.pdf?src-supplier=Element14; ComponentLink3Description: https://datasheet.ciiva.com/22673/1885357-22673083.pdf?src-supplier=Element14; Supplier 2: Digi-Key; Supplier 3: Digi-Key; Supplier Part Number 2: 541-10.0TCT-ND; Supplier Part Number 3: 541-10.0TDKR-ND
R41 R43 = RC0805JR-070RL: RES SMD 0805, 0 OHM JUMPER 1/8W; Manufacturer 1: Yageo; Tolerance: 5%; Temperature Coefficient: 200ppm/°C; Description 1: YAGEO         RC0805JR-070RL             RES, THICK FILM, 0R, 0.125W, 0805; Resistance: 0mR; Power Rating: 125mW; Voltage Rating: 150V; Supplier 1: Mouser; Stock 1: 18575448; Pricing 1: 1=0.1, 10=0.037, 25=0.0272, 50=0.0206, 100=0.0153, 250=0.01164, 500=0.0093, 1000=0.00685 (USD); Packaging: Tape and Reel; Composition: Thick Film; ComponentLink1URL: http://www.farnell.com/datasheets/1738694.pdf; ComponentLink1Description: http://www.farnell.com/datasheets/1738694.pdf; Supplier Part Number 1: 603-RC0805JR-070RL; Supplier 2: Digi-Key; Supplier Part Number 2: 311-0.0ARCT-ND; Case/Package: 0805; Number of Pins: 2; Contact Plating: Matte,Tin; Case Code (Imperial): 0805; Case Code (Metric): 2012; Min Operating Temperature: -55°C; Max Operating Temperature: 155°C; Voltage Rating (DC): 150V; Termination: SMD/SMT; Military Standard: Not; Length: 2mm; Height: 0.5mm; Width: 1.25mm; Depth: 1.25mm; Radiation Hardening: No; REACH SVHC: Unknown; Lead Free: Lead Free; ComponentLink2URL: http://documents.rs-components.com/techlib://itc_doclist_GB.htm?stockno=6185129; ComponentLink2Description: http://documents.rs-components.com/techlib://itc_doclist_GB.htm?stockno=6185129; ComponentLink3URL: https://www.verical.com/server-webapp/html/getDatasheet?partID=330685; ComponentLink3Description: https://www.verical.com/server-webapp/html/getDatasheet?partID=330685; Manufacturer Part Number: RC0805JR-070RL; Supplier 3: Digi-Key; Supplier Part Number 3: 311-0.0ARDKR-ND
R42 = ESR10EZPJ332: RES SMD 0805, 3.3K OHM 5% 0.4W; Manufacturer: Rohm; Value: 3.3kR; Temperature Coefficient: 200ppm/°C; Max Power Dissipation: 400mW; ComponentLink1Description: https://datasheet.ciiva.com/2515/esr-2515908.pdf?src-supplier=Digi-Key; ComponentLink1URL: https://datasheet.ciiva.com/2515/esr-2515908.pdf?src-supplier=Digi-Key; ComponentLink2URL: https://datasheet.ciiva.com/2515/esr-2515909.pdf?src-supplier=Digi-Key; ComponentLink2Description: https://datasheet.ciiva.com/2515/esr-2515909.pdf?src-supplier=Digi-Key; ComponentLink3URL: https://datasheet.ciiva.com/2515/esr-2515910.pdf?src-supplier=Digi-Key; ComponentLink3Description: https://datasheet.ciiva.com/2515/esr-2515910.pdf?src-supplier=Digi-Key; Supplier 1: Mouser; Manufacturer Part Number: ESR10EZPJ332; RoHS: Yes; Category: Chip SMD Resistors; Stock 1: 15240; Pricing 1: 1=0,13, 10=0,064, 50=0,064, 100=0,029, 1000=0,02, 10000=0,013 (USD); Min Operating Temperature: -55°C; Max Operating Temperature: 155°C; Tolerance: 5%; RoHS Compliant: Yes; Supplier Part Number 1: 755-ESR10EZPJ332; Case/Package: 0805; Case Code (Metric): 2012; Case Code (Imperial): 0805; Packaging: Cut Tape; Number of Terminations: 2; Features: Automotive AEC-Q200; Series: ESR; Ratings: AEC-Q200; Supplier 2: Digi-Key; Supplier 3: Digi-Key; Supplier Part Number 2: RHM3.3KKDKR-ND; Supplier Part Number 3: RHM3.3KKCT-ND
S2 = EVQ-P7A01P: Switch Tactile N.O. SPST Rectangular Button Gull Wing 0.05A 12VDC 2.2N SMD Embossed T/R; Manufacturer: Panasonic; Switch Function: Off-Mom; Max Voltage Rating (DC): 12V; Contact Resistance: 500mR; Contact Current Rating: 50mA; Electrical Life: 100000Cycles; Illumination Type: Non-Illuminated; Actuator Length: 0.65mm; Switch Travel: 0.2mm; Actuator Color: Black; Supplier 1: Mouser; Stock 1: 48946; Pricing 1: 1=0,28, 10=0,258, 50=0,258, 100=0,213, 1000=0,169, 10000=0,138 (USD); Min Operating Temperature: -20°C; Max Operating Temperature: 70°C; Throw Configuration: SPST; Operating Force: 2.2N; Packaging: Tape and Reel; Package Quantity: 5000; Orientation: Right Angle; Termination: Gull Wing; Radiation Hardening: No; ComponentLink1URL: https://www3.panasonic.biz/ac/e_download/control/switch/light-touch/catalog/sw_lt_eng_3529s_side.pdf; ComponentLink1Description: https://www3.panasonic.biz/ac/e_download/control/switch/light-touch/catalog/sw_lt_eng_3529s_side.pdf; Supplier Part Number 1: 667-EVQP7A01P; Case/Package: SMD/SMT; Mechanical Life: 100000Cycles; Lead Free: Lead Free; Manufacturer Part Number: EVQ-P7A01P; RoHS: Yes; Category: Tactile Switches; Mounting Technology: Surface Mount; Series: EVQP7; Reach SVHC Compliant: Unknown; ComponentLink2URL: https://datasheet.ciiva.com/30108/atk0000ce20-30108102.pdf?src-supplier=Onlinecomponents.com; ComponentLink2Description: https://datasheet.ciiva.com/30108/atk0000ce20-30108102.pdf?src-supplier=Onlinecomponents.com; Supplier 2: Digi-Key; Supplier 3: Digi-Key; Supplier Part Number 2: P16763CT-ND; Supplier Part Number 3: P16763DKR-ND
SIP2 = HT BREAKOUTBOARD: Pinos Fêmea para encaixe de HT Breakout
U2 = NEO-M9N-00B: GNSS module, Flash, TCXO, SAW, LNA, LCC, 12x16 mm Professional Grade; Manufacturer: u-blox; Supplier 1: Mouser; Manufacturer Part Number: NEO-M9N-00B; RoHS: Yes; Category: RF Receivers, Transceivers; Stock 1: 3456; Pricing 1: 1=27, 10=23,92, 50=19,61, 100=15,6801 (USD); RoHS Compliant: Yes; Supplier Part Number 1: 377-NEO-M9N-00B; Supplier 2: Digi-Key; Supplier Part Number 2: 672-NEO-M9N-00BCT-ND